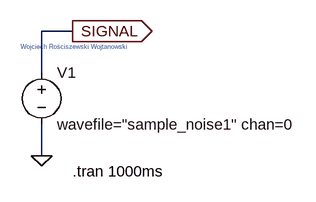
[diagram p0: schematic Adding WAV file to simulation.asc]
Adding WAV file to simulation.asc, the LTspice schematic file:
Version 4
SHEET 1 956 936
WIRE -304 32 -352 32
WIRE -352 96 -352 32
WIRE -352 224 -352 176
FLAG -352 224 0
FLAG -304 32 SIGNAL
IOPIN -304 32 Out
SYMBOL voltage -352 80 R0
WINDOW 123 0 0 Left 0
WINDOW 39 0 0 Left 0
SYMATTR InstName V1
SYMATTR Value wavefile="sample_noise1" chan=0
TEXT -304 248 Left 2 !.tran 1000ms
TEXT -384 56 Left 0 ;Wojciech Rościszewski Wojtanowski

The netlist it stands for:
* Adding WAV file to simulation.asc
V1 SIGNAL 0 wavefile="sample_noise1" chan=0
.tran 1000ms
* Wojciech Rościszewski Wojtanowski
.backanno
.end